# Altium project PCB_Project1.PrjPCB
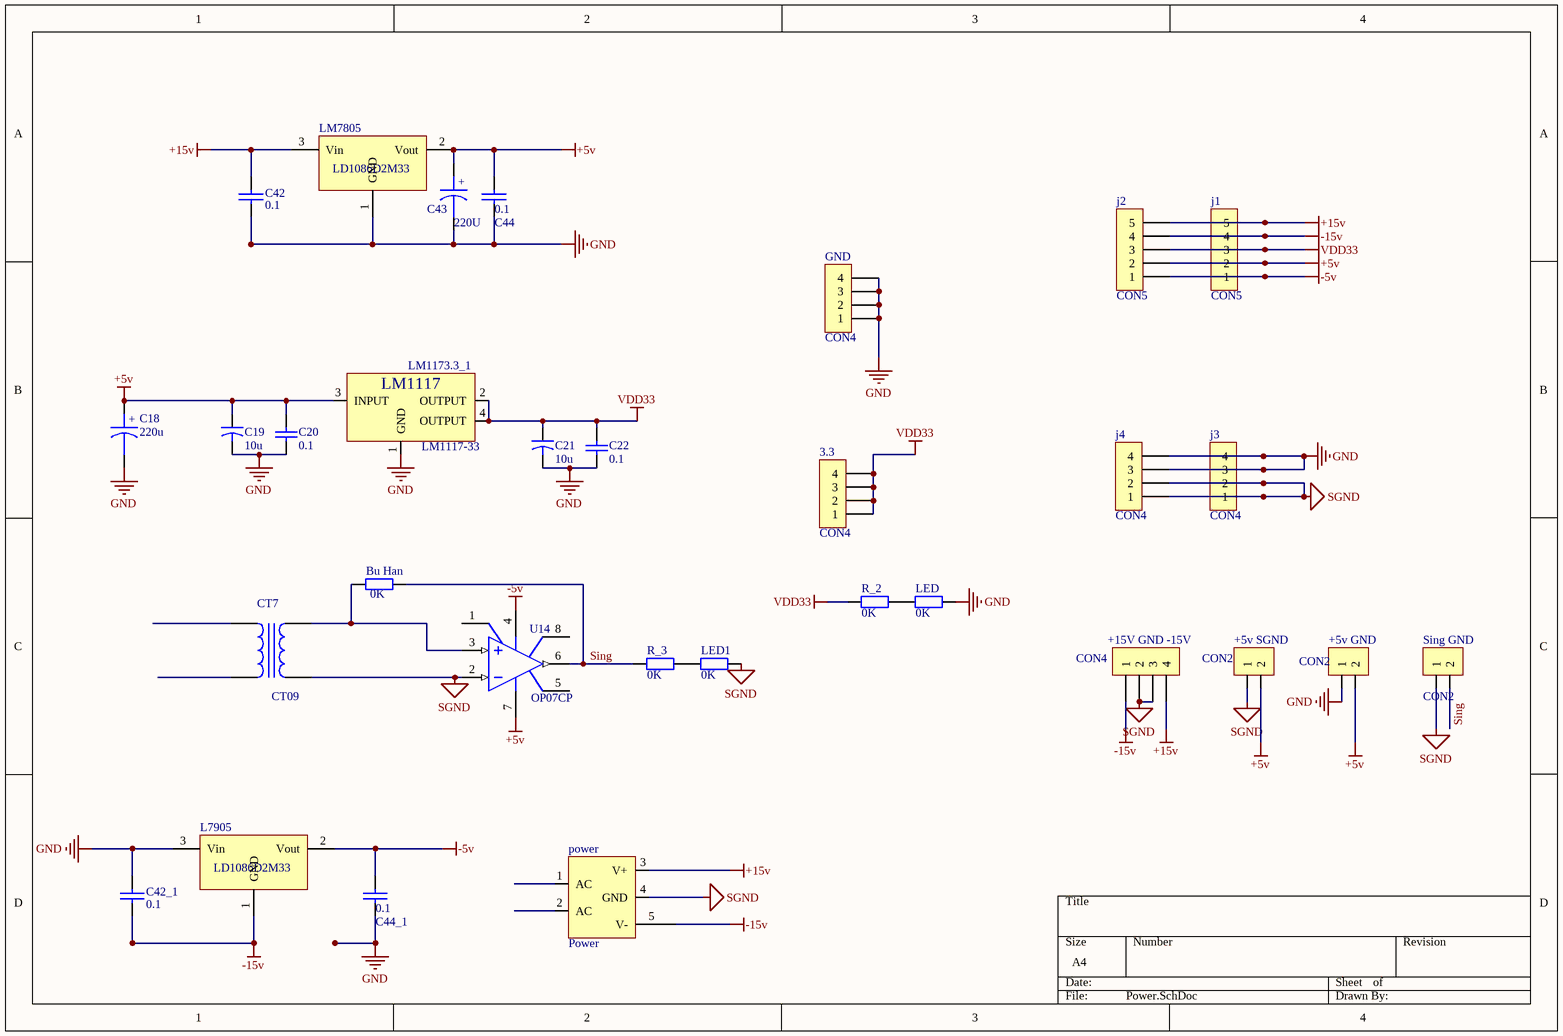
[diagram p0: Power.SchDoc]
1 sheet, 31 parts. Net scope: global (net labels, ports and power ports of the same name join across sheets).
Board file: Power.PcbDoc

## Sheet Power.SchDoc
size A4

### Parts
3.3  CON4  [CON4]
+5v_GND  CON2  [CON2/0.4]
+5v_SGND  CON2  [CON2/0.4]
+15V_GND_-15V  CON4  [CON4/0.4]
Bu_Han  0K  [0805]
C18  220u  [C-RVE]
C19  10u  [c-1206]
C20  0.1  [0805]
C21  10u  [c-1206]
C22  0.1  [0805]
C42  0.1  [0805]
C42_1  0.1  [0805]
C43  220U  [CD4]
C44  0.1  [0805]
C44_1  0.1  [0805]
CT7  CT09  [TRA1]
GND  CON4  [CON4]
j1  CON5  [CON5/0.4]
j2  CON5  [CON5/0.4]
j3  CON4  [CON4]
j4  CON4  [CON4]
L7905  LD1086D2M33  [D2PAK/A]
LED  0K  [LED_贴_1]
LED1  0K  [LED_贴_1]
LM1173.3_1  LM1117-33  [SOT223]
LM7805  LD1086D2M33  [D2PAK/A]
power  Power  [power]
R_2  0K  [0805]
R_3  0K  [0805]
Sing_GND  CON2  [CON2/0.4]
U14  OP07CP  [SOP127P600X175-8N]

### Nets
+5v: +5v_GND.2 +5v_SGND.2 C18.1 C19.1 C20.1 C43.1 C44.1 j1.2 j2.2 LM1173.3_1.3(INPUT) LM7805.2(Vout) U14.7(V+)
+15v: +15V_GND_-15V.4 C42.1 j1.5 j2.5 LM7805.3(Vin) power.3(V+)
-5v: C44_1.1 j1.1 j2.1 L7905.2(Vout) U14.4(V-)
-15v: +15V_GND_-15V.1 C42_1.2 j1.4 j2.4 L7905.1(GND) power.5(V-)
GND: +5v_GND.1 C18.2 C19.2 C20.2 C21.2 C22.2 C42.2 C42_1.1 C43.2 C44.2 C44_1.2 GND.1 GND.2 GND.3 GND.4 j3.3 j3.4 j4.3 j4.4 L7905.3(Vin) LED.2 LM1173.3_1.1(GND) LM7805.1(GND)
SGND: +5v_SGND.1 +15V_GND_-15V.2 +15V_GND_-15V.3 CT7.1 j3.1 j3.2 j4.1 j4.2 LED1.2 power.4(GND) Sing_GND.1 U14.2(IN-)
VDD33: 3.3.1 3.3.2 3.3.3 3.3.4 C21.1 C22.1 j1.3 j2.3 LM1173.3_1.2(OUTPUT) LM1173.3_1.4(OUTPUT) R_2.1
Sing: Bu_Han.2 R_3.1 Sing_GND.2 U14.6(OUT)
NetBu_Han_1: Bu_Han.1 CT7.2 U14.3(IN+)
NetLED1_1: LED1.1 R_3.2
NetLED_1: LED.1 R_2.2

Not connected (* = marked no-connect by the designer): CT7 3 4; power 1(AC) 2(AC); U14 1(NULL1) 5(NC) 8(NULL2)

### Notes on the sheet
- (in symbol CAPACITOR POL) +

### Library data of the parts
3.3 +15V_GND_-15V GND j3 j4 = CON4: Connector
+5v_GND +5v_SGND Sing_GND = CON2: Connector
Bu_Han LED LED1 R_2 R_3 = Res2: Resistor; Value: 47K; Published: 8-Jun-2000; LatestRevisionDate: 17-Jul-2002; LatestRevisionNote: Re-released for DXP Platform.; PackageReference: AXIAL-0.4; Publisher: Altium Limited
C18 C43 = CAPACITOR POL: Capacitor
C19 C21 = Cap2: Capacitor; Value: 0.1u; Published: 23-Sep-2002; Publisher: Altium Limited
C20 C22 = Cap: Capacitor; Value: 0.1u; Published: 8-Jun-2000; LatestRevisionDate: 17-Jul-2002; LatestRevisionNote: Re-released for DXP Platform.; PackageReference: RAD-0.3; Publisher: Altium Limited
C42 C42_1 C44 C44_1 = CAP: Capacitor
j1 j2 = CON5: Connector
L7905 LM7805 = LM1086: pin to pad: 1>2 2>3 3>1
LM1173.3_1 = LM1117
power = Power: pin to pad: 1>4 2>3 3>2 4>1 5>0
U14 = OP07CN: Very Low Offset Single Bipolar Operational Amplifier; Text Field6: Pins 5 is Not Connected; Text Field7: Published 24-Aug-2001